# Altium schematic sheet Breakout.SchDoc
size A4; SheetNumber: 1; SheetTotal: 1
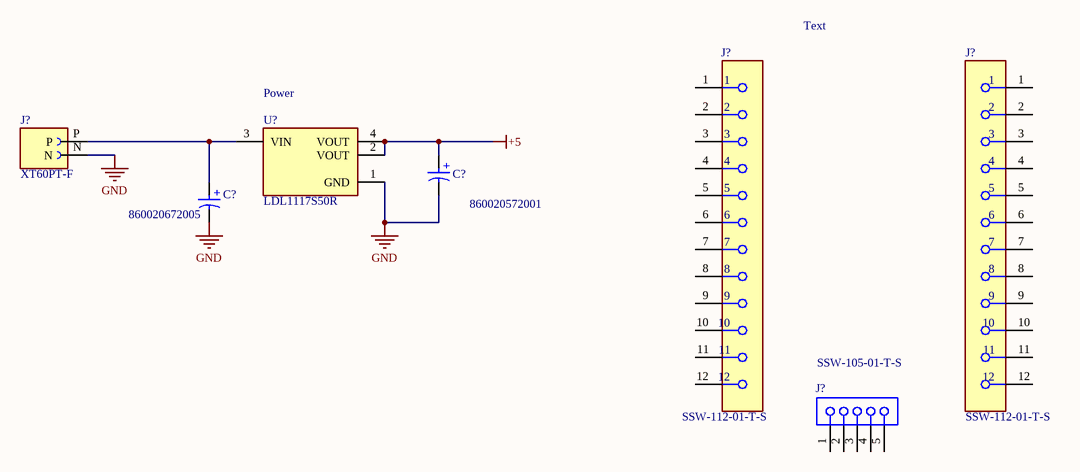
[diagram p0: Breakout.SchDoc]

## Parts
(Parts that share a designator on the sheet are numbered #1, #2 ... from top to bottom, then left to right.)
C?#1  860020572001  [WCAP-ATG5_D5H11]
C?#2  860020672005  [WCAP-ATG5_D5H11]
J?#1  SSW-112-01-T-S  [FP-SSW-112-01-T-S-MFG]
J?#2  SSW-112-01-T-S  [FP-SSW-112-01-T-S-MFG]
J?#3  XT60PT-F  [AMASS_XT60PT-F]
J?#4  SSW-105-01-T-S  [SMTC-SSW-105-01-X-S]
U?  LDL1117S50R  [FP-SOT-223-0046067_14-MFG]

## Nets
+5: C?#1.1(P) U?.2(VOUT) U?.4(VOUT)
GND: C?#1.2(N) C?#2.2(N) J?#3.N U?.1(GND)
NetC?#2_1: C?#2.1(P) J?#3.P U?.3(VIN)

Not connected (* = marked no-connect by the designer): J?#1 1 2 3 4 5 6 7 8 9 10 11 12; J?#2 1 2 3 4 5 6 7 8 9 10 11 12; J?#4 1 2 3 4 5

## Notes on the sheet
- Text
- (near U?) Power
- (in symbol CMP-03913-53914201-2) +
- (in symbol CMP-03913-53914228-1) +

## Library data of the parts
C?#1 = CMP-03913-53914201-2: WCAP-ATG5 Aluminum Electrolytic Capacitors; Tolerance: 20%; Pitch: 2mm; Polarity: Polar; Life (Hours): 2000hours; Voltage Rating: 35V; Capacitance: 4.7µF; Ripple Current: 28mA; Leakage Current: 3µA; Height - Seated (Max): 12.4968mm; RoHS: Compliant; Height: 11mm; REACH SVHC: Unknown; Diameter: 5mm; Lead Pitch: 2.0066mm; Voltage Rating (DC): 35V; Length: 11mm; Mount: Through Hole; Packaging: Tape & Box (TB); Case/Package: Radial; Max Operating Temperature: 105°C; Min Operating Temperature: -40°C
C?#2 = CMP-03913-53914228-1: 860020672005 WCAP-ATG5 Aluminum Electrolytic Capacitors; Voltage Rating: 50V; Ripple Current: 13mA; Pitch: 2mm; Tolerance: 20%; Leakage Current: 3µA; Polarity: Polar; Capacitance: 1µF; ESR (Equivalent Series Resistance): 39.553Ω; Hole Diameter: 800µm; Life (Hours): 2000hours; Lead Pitch: 2.0066mm; Max Operating Temperature: 105°C; Packaging: Tape & Box (TB); Height - Seated (Max): 12.4968mm; Min Operating Temperature: -40°C; Height: 11mm; Length: 11mm; Diameter: 5mm; Case/Package: Radial; Voltage Rating (DC): 50V; RoHS: Compliant; REACH SVHC: Unknown; Mount: Through Hole; NexarPartId: 53914228
J?#1 J?#2 = CMP-1023-00407-2: CONN RCPT 12POS 0.1 TIN PCB; Mating Cycles: 100; Contact Resistance: 10mR; Number of Positions: 12; Gender: Receptacle; Max Current Rating: 6.9A; Max Voltage Rating (AC): 550V; Pitch: 2.54mm; Mount: Through Hole; Contact Plating: Tin; Contact Type: Female Socket; Termination: Solder; RoHS Compliant: Yes; Depth: 2.41mm; Packaging: Bulk; Contact Material: Bronze; Connector Type: Receptacle; Housing Color: Black; Width: 2.41mm; Length: 30.99mm; Lead Free: Lead Free; REACH SVHC: No SVHC; Number of Contacts: 12; Housing Material: Polymer; Series: SSW; Orientation: Vertical; Max Operating Temperature: 105°C; Color: Black; Min Operating Temperature: -55°C; Number of Rows: 1
J?#3 = XT60PT-F: XT dual pin horizontal connector - Female, 500V DC Supply, 30A, Yellow; MF: amass; SnapEDA_Link: https://www.snapeda.com/parts/XT60PT-F/AMASS/view-part/?ref=snap; Package: None; Value: *; MP: XT60PT-F; Check_prices: https://www.snapeda.com/parts/XT60PT-F/AMASS/view-part/?ref=eda
J?#4 = CMP-1023-00345-1: SQ Post Socket, Through-hole, Vertical, -55 to 105 degC, 2.54mm Pitch, 5-Pin, Female, RoHS; Manufacturer: Samtec; Pitch: 2.54 mm; Orientation: Vertical; ComponentLink1Description: Manufacturer URL; ComponentLink1URL: http://www.samtec.com; RoHS: True; PackageDescription: Assembly, Socket Strip .016 X .031 Tail; PackageReference: SSW-105-01-X-S; ComponentLink3URL: http://www.samtec.com/documents/webfiles/cpdf/SSW-1XX-XX-XXX-X-XX-XXX-XX-MKT.pdf; PartNumber: SSW-105-01-T-S; Temperature Range: -55 to 105 degC; Mounting Technology: Through-hole; PackageVersion: CA, 6/1987; ComponentLink2URL: http://www.samtec.com/documents/webfiles/pdf/SSW_TH.PDF; DatasheetVersion: F-214; ComponentLink2Description: Datasheet; ComponentLink3Description: Package Specification
U? = CMP-12153-000005-1: IC REG LINEAR 5V 1.2A SOT223; Manufacturer: STMicroelectronics; Standoff Height: 0.02mm; Min Supply Voltage: 2.6V; Nominal Supply Current: 250uA; Description: Linear Voltage Regulator IC  1 Output  1.2A SOT-223; Max Junction Temp: +150°C; Accuracy Percentage: 2%; Output Type: Fixed; Max Supply Voltage: 18V; Output Current: 2A; Number Of Outputs: 1; Dropout Voltage: 350mV; ComponentLink2Description: Datasheet; Temperature Range High: +125°C; Manufacturer Part Number: LDL1117S50R; Digikey Description: IC REG LINEAR 5V 1.2A SOT223; Device Class L2: Power Management ICs; RoHS: TRUE; Temperature: -40°C to +125°C; Device Class L3: Voltage Regulators - Linear; Automotive: No; Mouser Description: LDL1117 Series 1.2 A 5 V High PSRR LDO Linear Voltage Regulator - SOT-223; Package: SOT-223-0046067_14; ComponentLink2URL: https://www.st.com/content/ccc/resource/technical/document/datasheet/group3/0e/5a/00/ca/10/1a/4f/a5/DM00366442/files/DM00366442.pdf/jcr:content/translations/en.DM00366442.pdf; Output Voltage: 5V; Octopart: https://octopart.com/ldl1117s50r-stmicroelectronics-81876164; Category: IC; Device Class L1: Integrated Circuits (ICs); Temperature Range Low: -40°C; Height: 1.9mm; Lead Free: Yes